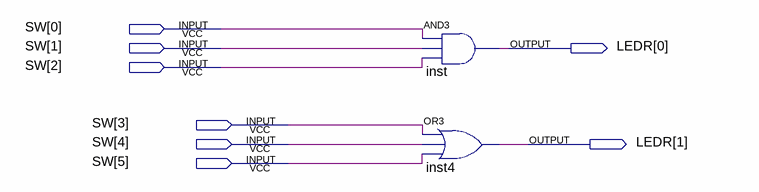
[diagram p0: schematic sheet]
// Quartus schematic logika.bdf as structural Verilog: 2 symbols, 8 pins
module logika (
  input  [5:0] SW,
  output [1:0] LEDR
);

  and inst (LEDR[0], SW[0], SW[1], SW[2]);
  or inst4 (LEDR[1], SW[3], SW[4], SW[5]);
endmodule
